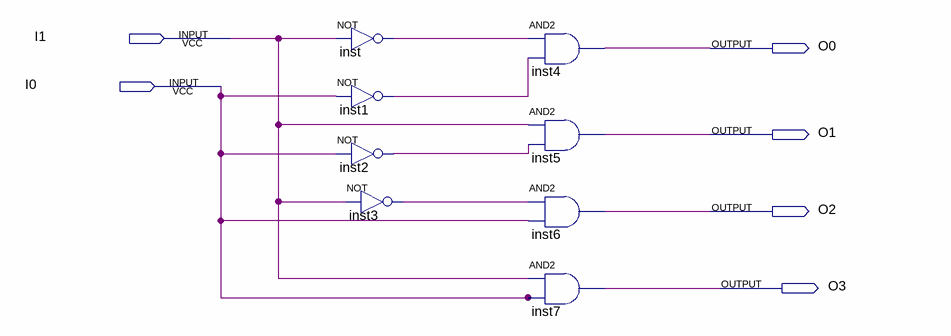
[diagram p0: schematic sheet]
// Quartus schematic decoder_2x4.bdf as structural Verilog: 8 symbols, 6 pins
module decoder_2x4 (
  input  I1,
  input  I0,
  output O0,
  output O1,
  output O2,
  output O3
);

  wire inst1_out, inst2_out, inst3_out, inst_out;

  not inst (inst_out, I1);
  not inst1 (inst1_out, I0);
  not inst2 (inst2_out, I0);
  not inst3 (inst3_out, I1);
  and inst4 (O0, inst_out, inst1_out);
  and inst5 (O1, I1, inst2_out);
  and inst6 (O2, inst3_out, I0);
  and inst7 (O3, I1, I0);
endmodule
